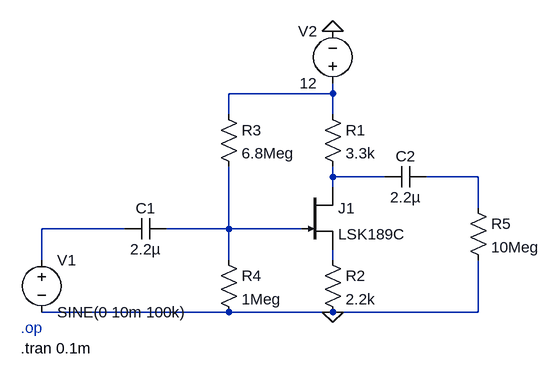
[diagram p0: schematic Draft4.asc]
Draft4.asc, the LTspice schematic file:
Version 4.1
SHEET 1 880 680
WIRE 272 -32 272 -48
WIRE 272 -32 112 -32
WIRE 112 0 112 -32
WIRE 272 0 272 -32
WIRE 272 96 272 80
WIRE 352 96 272 96
WIRE 496 96 416 96
WIRE 272 112 272 96
WIRE 496 144 496 96
WIRE -48 176 -176 176
WIRE 112 176 112 80
WIRE 112 176 16 176
WIRE 224 176 112 176
WIRE -176 224 -176 176
WIRE 112 224 112 176
WIRE 272 224 272 208
WIRE 112 304 -176 304
WIRE 272 304 112 304
WIRE 496 304 496 224
WIRE 496 304 272 304
FLAG 272 304 0
FLAG 272 -128 0
DATAFLAG 160 176 ""
DATAFLAG 304 96 ""
SYMBOL njf 224 112 R0
SYMATTR InstName J1
SYMATTR Value LSK189C
SYMBOL res 256 -16 R0
SYMATTR InstName R1
SYMATTR Value 3.3k
SYMBOL res 256 208 R0
SYMATTR InstName R2
SYMATTR Value 2.2k
SYMBOL res 96 -16 R0
SYMATTR InstName R3
SYMATTR Value 6.8Meg
SYMBOL res 96 208 R0
SYMATTR InstName R4
SYMATTR Value 1Meg
SYMBOL cap 16 160 R90
WINDOW 0 0 32 VBottom 2
WINDOW 3 32 32 VTop 2
SYMATTR InstName C1
SYMATTR Value 2.2µ
SYMBOL cap 416 80 R90
WINDOW 0 0 32 VBottom 2
WINDOW 3 32 32 VTop 2
SYMATTR InstName C2
SYMATTR Value 2.2µ
SYMBOL voltage -176 208 R0
WINDOW 123 0 0 Left 0
WINDOW 39 0 0 Left 0
SYMATTR InstName V1
SYMATTR Value SINE(0 10m 100k)
SYMBOL voltage 272 -32 R180
WINDOW 0 24 96 Left 2
WINDOW 3 24 16 Left 2
WINDOW 123 0 0 Left 0
WINDOW 39 0 0 Left 0
SYMATTR InstName V2
SYMATTR Value 12
SYMBOL res 480 128 R0
SYMATTR InstName R5
SYMATTR Value 10Meg
TEXT -208 328 Left 2 ;.op
TEXT -208 360 Left 2 !.tran 0.1m

The netlist it stands for:
* Draft4.asc
J1 N002 N005 N006 LSK189C
R1 N001 N002 3.3k
R2 N006 0 2.2k
R3 N001 N005 6.8Meg
R4 N005 0 1Meg
C1 N005 N004 2.2µ
C2 N003 N002 2.2µ
V1 N004 0 SINE(0 10m 100k)
V2 N001 0 12
R5 N003 0 10Meg
.model NJF NJF
.model PJF PJF
.lib standard.jft
* .op
.tran 0.1m
.backanno
.end